# EAGLE schematic csa_petio_v1.3a (EAGLE 6.4)
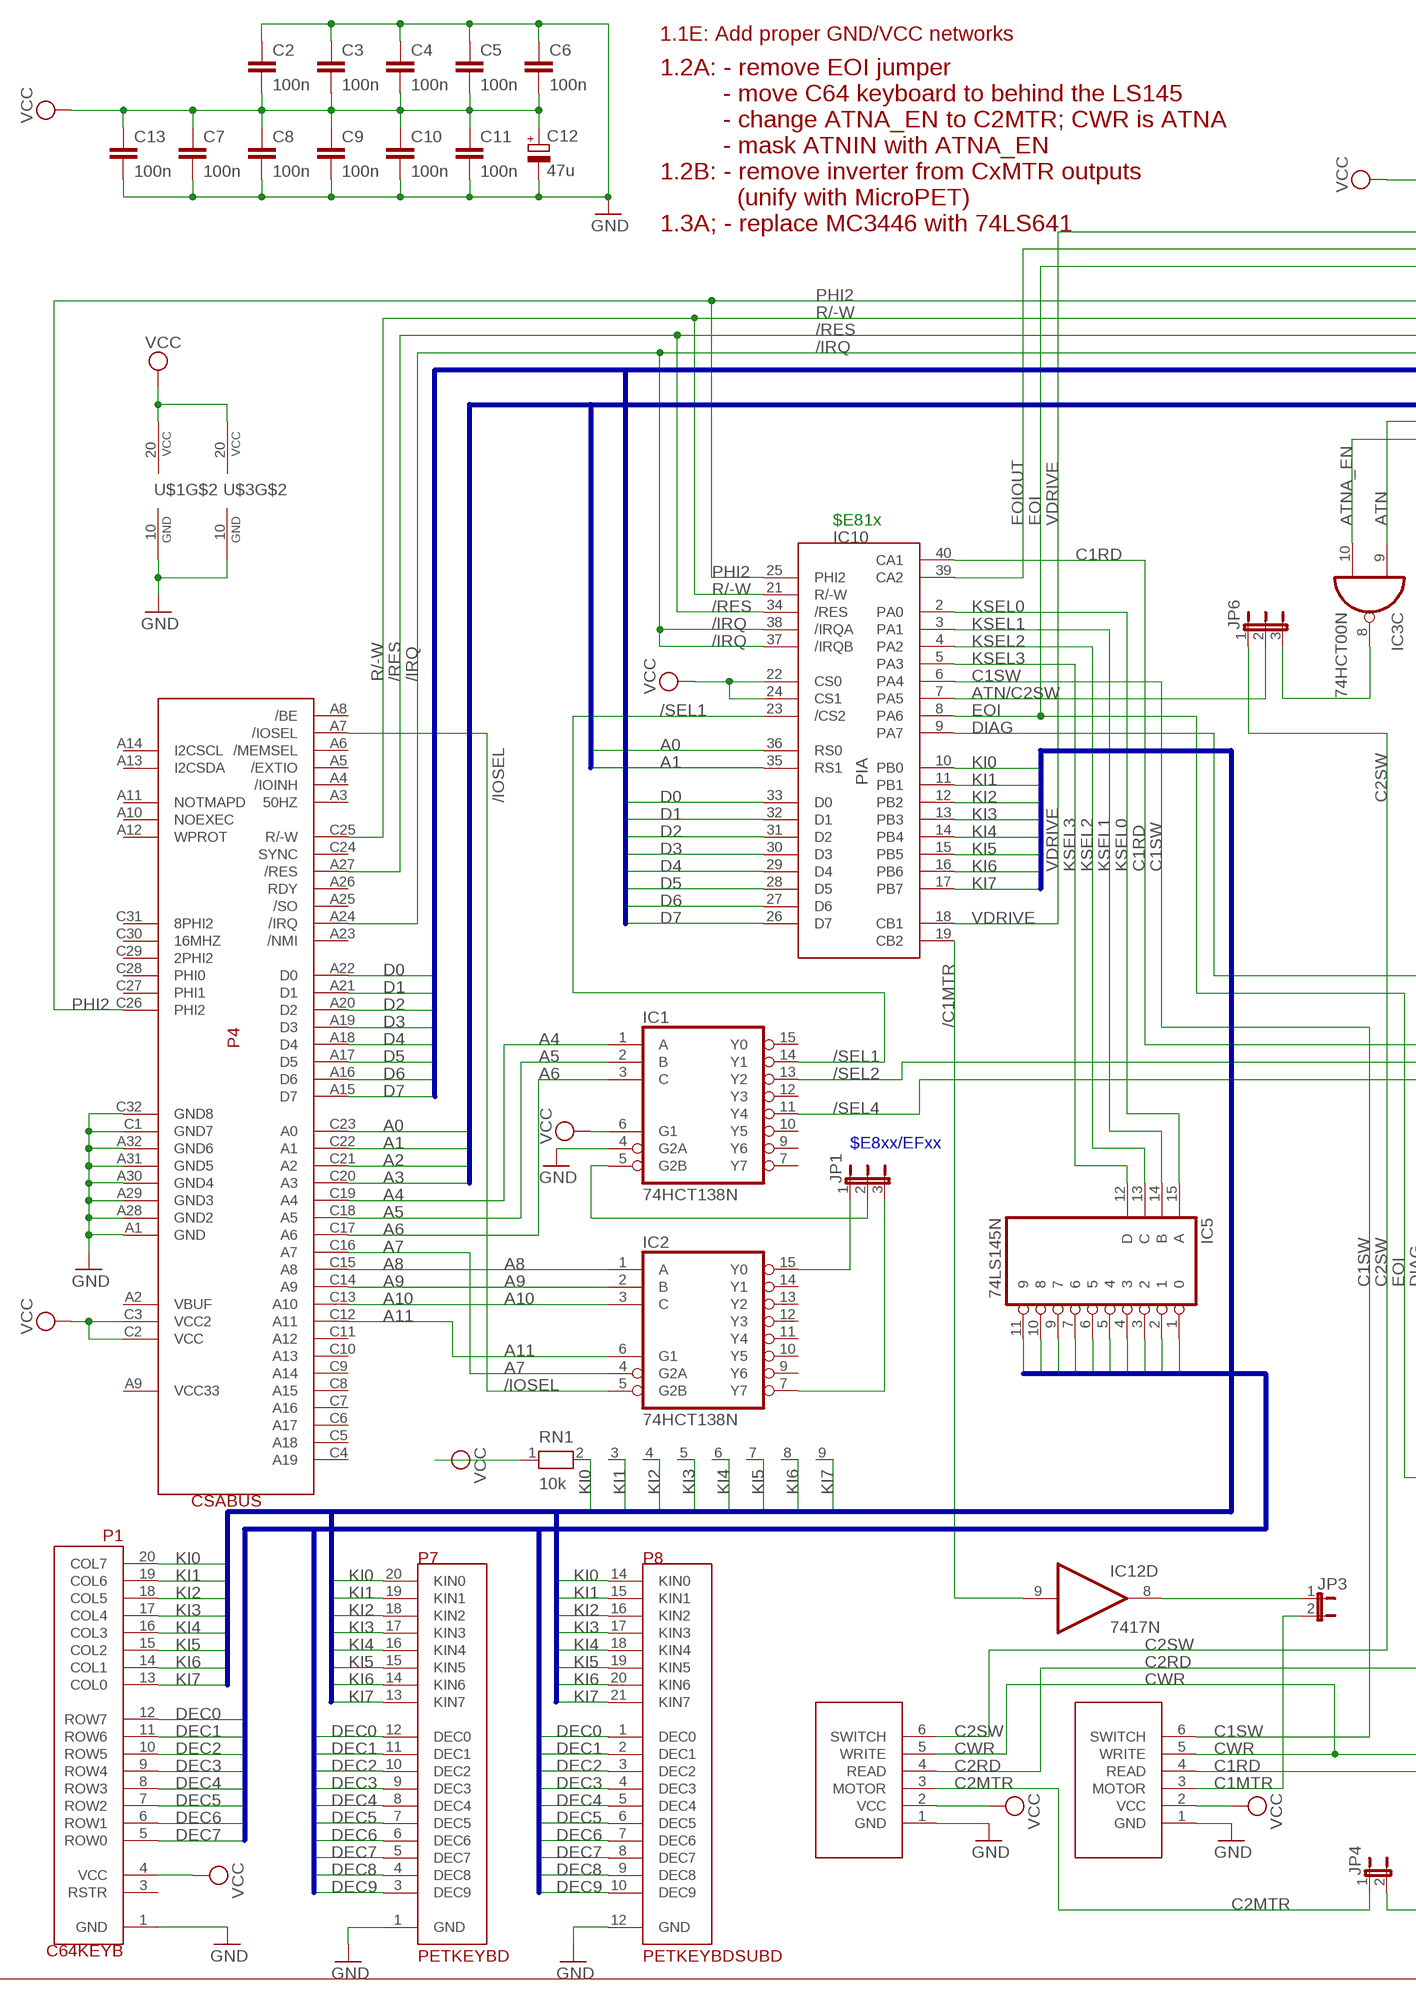
[diagram p0: schematic, sheet 1, part 1 of 2]
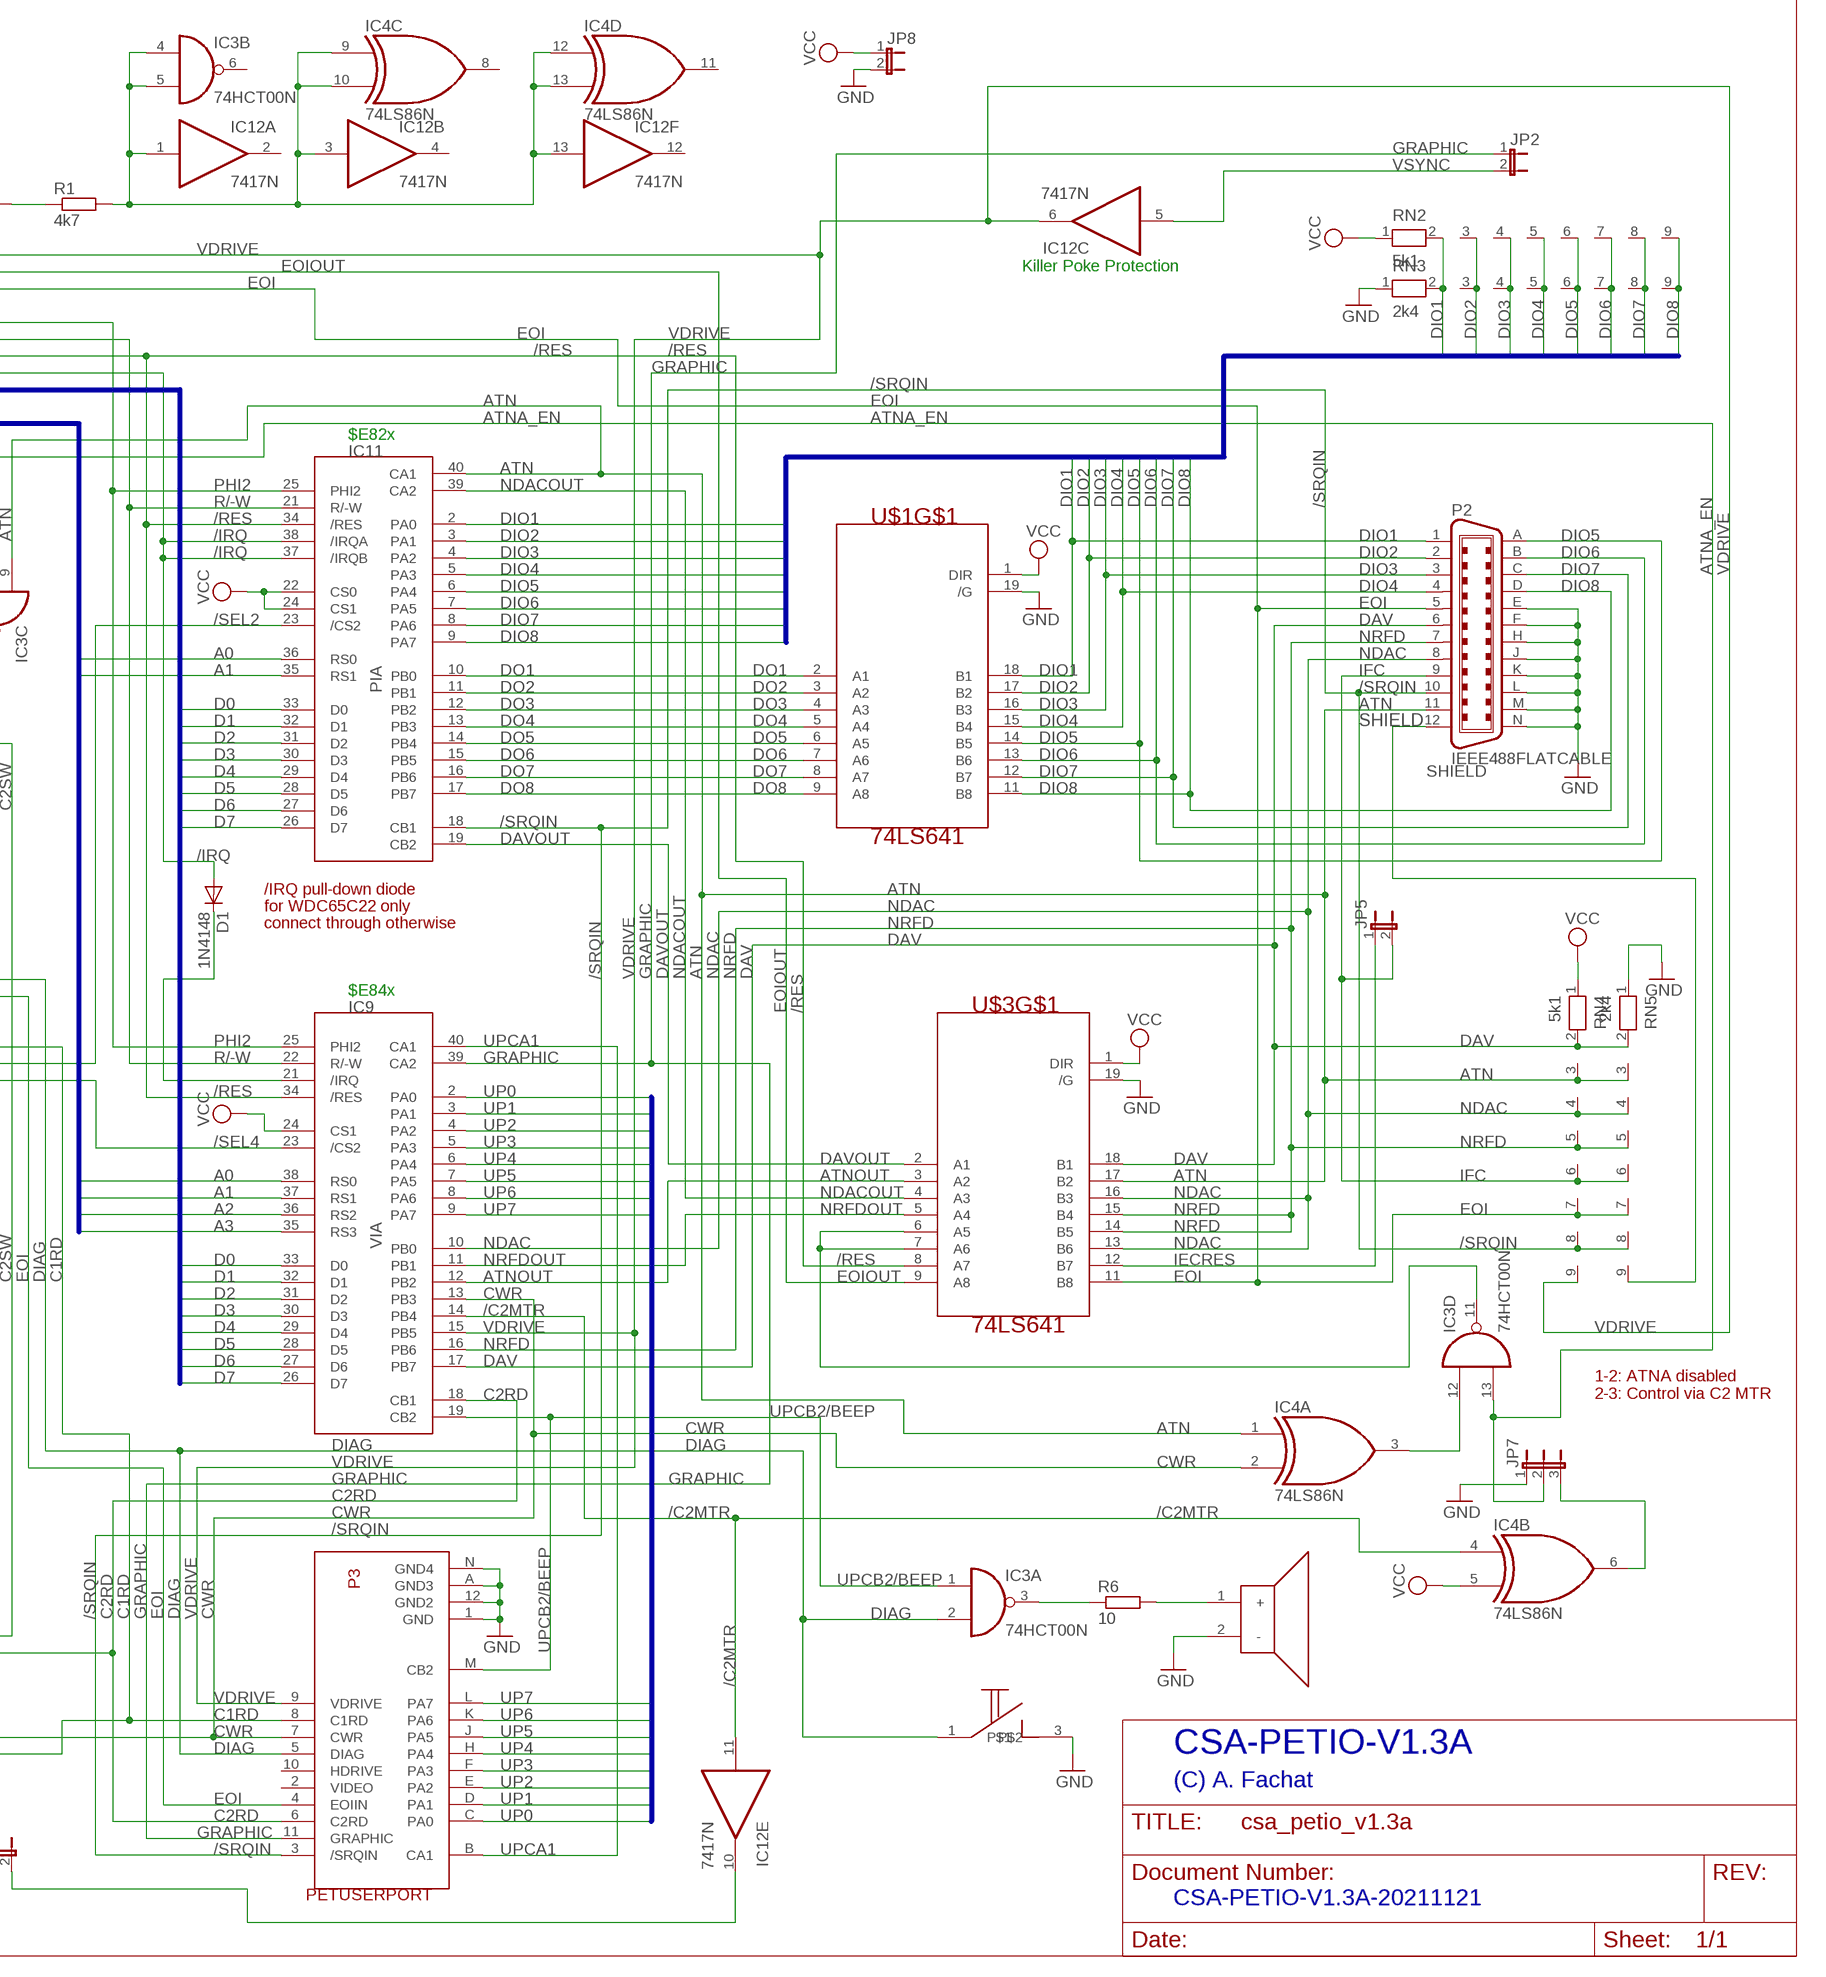
[diagram p1: schematic, sheet 1, part 2 of 2]

## Parts
BEEP1  PIEZOBEEPERPIEZO  [PIEZOBEEPER]
C2  100n  C-EU025-025X050  [C025-025X050]
C3  100n  C-EU025-025X050  [C025-025X050]
C4  100n  C-EU025-025X050  [C025-025X050]
C5  100n  C-EU025-025X050  [C025-025X050]
C6  100n  C-EU025-025X050  [C025-025X050]
C7  100n  C-EU025-025X050  [C025-025X050]
C8  100n  C-EU025-025X050  [C025-025X050]
C9  100n  C-EU025-025X050  [C025-025X050]
C10  100n  C-EU025-025X050  [C025-025X050]
C11  100n  C-EU025-025X050  [C025-025X050]
C12  47u  CPOL-EUE2.5-6  [E2,5-6]
C13  100n  C-EU025-025X050  [C025-025X050]
D1  1N4148  DIODE-D-5  [D-5]
IC1  74HCT138N  [DIL16]
IC2  74HCT138N  [DIL16]
IC3  74HCT00N  [DIL14]
IC4  74LS86N  [DIL14]
IC5  74LS145N  [DIL16]
IC9  VIA  [DIL40]
IC10  PIA  [DIL40]
IC11  PIA  [DIL40]
IC12  7417N  [DIL14]
JP1  JP2E  [JP2]
JP2  JP1E  [JP1]
JP3  JP1E  [JP1]
JP4  JP1E  [JP1]
JP5  JP1E  [JP1]
JP6  JP2E  [JP2]
JP7  JP2E  [JP2]
JP8  JP1E  [JP1]
P1  C64KEYB  [C64KEYB]
P2  IEEE488FLATCABLE  [FLAT24]
P3  PETUSERPORT  [FLAT24]
P4  CSABUS  [CSABUS]
P5  CBMTAPE  [JP6]
P6  CBMTAPE  [JP6]
P7  PETKEYBD  [C64KEYB]
P8  PETKEYBDSUBD  [SUBD25F]
R1  4k7  R-EU_0207/10  [0207/10]
R6  10  R-EU_0207/10  [0207/10]
RN1  10k  RN08  [RN-9]
RN2  5k1  RN08  [RN-9]
RN3  2k4  RN08  [RN-9]
RN4  5k1  RN08  [RN-9]
RN5  2k4  RN08  [RN-9]
U$1  74LS641  [DIL20]
U$2  TASTER  [TASTER]
U$3  74LS641  [DIL20]

## Nets
//C2MTR: IC4.6(B:O) JP7.3
/C1MTR: IC10.19(CB2) IC12.9(D:I)
/C2MTR: IC4.4(B:I0) IC9.14(PB4) IC12.11(E:I)
/IOSEL: IC2.5(G2B) P4.A7(/IOSEL)
/IRQ: D1.A IC10.37(/IRQB) IC10.38(/IRQA) IC11.37(/IRQB) IC11.38(/IRQA) P4.A24(/IRQ)
/RES: IC9.34(/RES) IC10.34(/RES) IC11.34(/RES) P4.A27(/RES) U$3.8(A7)
/SEL1: IC1.14(Y1) IC10.23(/CS2)
/SEL2: IC1.13(Y2) IC11.23(/CS2)
/SEL4: IC1.11(Y4) IC9.23(/CS2)
/SRQIN: IC11.18(CB1) P2.10 P3.3(/SRQIN) RN4.8 RN5.8
A0: IC9.38(RS0) IC10.36(RS0) IC11.36(RS0) P4.C23(A0)
A1: IC9.37(RS1) IC10.35(RS1) IC11.35(RS1) P4.C22(A1)
A2: IC9.36(RS2) P4.C21(A2)
A3: IC9.35(RS3) P4.C20(A3)
A4: IC1.1(A) P4.C19(A4)
A5: IC1.2(B) P4.C18(A5)
A6: IC1.3(C) P4.C17(A6)
A7: IC2.4(G2A) P4.C16(A7)
A8: IC2.1(A) P4.C15(A8)
A9: IC2.2(B) P4.C14(A9)
A10: IC2.3(C) P4.C13(A10)
A11: IC2.6(G1) P4.C12(A11)
ATN: IC3.9(C:I0) IC4.1(A:I0) IC11.40(CA1) P2.11 RN4.3 RN5.3 U$3.17(B2)
ATN/C2SW: IC10.7(PA5) JP6.2
ATNA_EN: IC3.10(C:I1) IC3.13(D:I1) JP7.2
ATNOUT: IC9.12(PB2) U$3.3(A2)
C1MTR: JP3.2 P5.3(MOTOR)
C1RD: IC10.40(CA1) P3.8(C1RD) P5.4(READ)
C1SW: IC10.6(PA4) P5.6(SWITCH)
C2MTR: JP4.1 P6.3(MOTOR)
C2RD: IC9.18(CB1) P3.6(C2RD) P6.4(READ)
C2SW: JP6.1 P6.6(SWITCH)
CWR: IC4.2(A:I1) IC9.13(PB3) P3.7(CWR) P5.5(WRITE) P6.5(WRITE)
D0: IC9.33(D0) IC10.33(D0) IC11.33(D0) P4.A22(D0)
D1: IC9.32(D1) IC10.32(D1) IC11.32(D1) P4.A21(D1)
D2: IC9.31(D2) IC10.31(D2) IC11.31(D2) P4.A20(D2)
D3: IC9.30(D3) IC10.30(D3) IC11.30(D3) P4.A19(D3)
D4: IC9.29(D4) IC10.29(D4) IC11.29(D4) P4.A18(D4)
D5: IC9.28(D5) IC10.28(D5) IC11.28(D5) P4.A17(D5)
D6: IC9.27(D6) IC10.27(D6) IC11.27(D6) P4.A16(D6)
D7: IC9.26(D7) IC10.26(D7) IC11.26(D7) P4.A15(D7)
DAV: IC9.17(PB7) P2.6 RN4.2 RN5.2 U$3.18(B1)
DAVOUT: IC11.19(CB2) U$3.2(A1)
DEC0: IC5.1 P1.12(ROW7) P7.12(DEC0) P8.1(DEC0)
DEC1: IC5.2 P1.11(ROW6) P7.11(DEC1) P8.2(DEC1)
DEC2: IC5.3 P1.10(ROW5) P7.10(DEC2) P8.3(DEC2)
DEC3: IC5.4 P1.9(ROW4) P7.9(DEC3) P8.4(DEC3)
DEC4: IC5.5 P1.8(ROW3) P7.8(DEC4) P8.5(DEC4)
DEC5: IC5.6 P1.7(ROW2) P7.7(DEC5) P8.6(DEC5)
DEC6: IC5.7 P1.6(ROW1) P7.6(DEC6) P8.7(DEC6)
DEC7: IC5.9 P1.5(ROW0) P7.5(DEC7) P8.8(DEC7)
DEC8: IC5.10 P7.4(DEC8) P8.9(DEC8)
DEC9: IC5.11 P7.3(DEC9) P8.10(DEC9)
DIAG: IC3.2(A:I1) IC10.9(PA7) P3.5(DIAG) U$2.1
DIO1: IC11.2(PA0) P2.1 RN2.2 RN3.2 U$1.18(B1)
DIO2: IC11.3(PA1) P2.2 RN2.3 RN3.3 U$1.17(B2)
DIO3: IC11.4(PA2) P2.3 RN2.4 RN3.4 U$1.16(B3)
DIO4: IC11.5(PA3) P2.4 RN2.5 RN3.5 U$1.15(B4)
DIO5: IC11.6(PA4) P2.A RN2.6 RN3.6 U$1.14(B5)
DIO6: IC11.7(PA5) P2.B RN2.7 RN3.7 U$1.13(B6)
DIO7: IC11.8(PA6) P2.C RN2.8 RN3.8 U$1.12(B7)
DIO8: IC11.9(PA7) P2.D RN2.9 RN3.9 U$1.11(B8)
DO1: IC11.10(PB0) U$1.2(A1)
DO2: IC11.11(PB1) U$1.3(A2)
DO3: IC11.12(PB2) U$1.4(A3)
DO4: IC11.13(PB3) U$1.5(A4)
DO5: IC11.14(PB4) U$1.6(A5)
DO6: IC11.15(PB5) U$1.7(A6)
DO7: IC11.16(PB6) U$1.8(A7)
DO8: IC11.17(PB7) U$1.9(A8)
EOI: IC10.8(PA6) P2.5 P3.4(EOIIN) RN4.7 RN5.7 U$3.11(B8)
EOIOUT: IC10.39(CA2) U$3.9(A8)
GND: BEEP1.2(-) C2.1 C3.1 C4.1 C5.1 C6.1 C7.2 C8.2 C9.2 C10.2 C11.2 C12.- C13.2 IC1.4(G2A) JP7.1 JP8.2 P1.1(GND) P2.E P2.F P2.H P2.J P2.K P2.L P2.M P2.N P3.1(GND) P3.12(GND2) P3.A(GND3) P3.N(GND4) P4.A1(GND) P4.A28(GND2) P4.A29(GND3) P4.A30(GND4) P4.A31(GND5) P4.A32(GND6) P4.C1(GND7) P4.C32(GND8) P5.1(GND) P6.1(GND) P7.1(GND) P8.12(GND) RN3.1 RN5.1 U$1.10(GND) U$1.19(/G) U$2.3 U$3.10(GND) U$3.19(/G)
GRAPHIC: IC9.39(CA2) JP2.1 P3.11(GRAPHIC)
IECRES: JP5.1 U$3.12(B7)
IFC: JP5.2 P2.9 RN4.6 RN5.6
KI0: IC10.10(PB0) P1.20(COL7) P7.20(KIN0) P8.14(KIN0) RN1.2
KI1: IC10.11(PB1) P1.19(COL6) P7.19(KIN1) P8.15(KIN1) RN1.3
KI2: IC10.12(PB2) P1.18(COL5) P7.18(KIN2) P8.16(KIN2) RN1.4
KI3: IC10.13(PB3) P1.17(COL4) P7.17(KIN3) P8.17(KIN3) RN1.5
KI4: IC10.14(PB4) P1.16(COL3) P7.16(KIN4) P8.18(KIN4) RN1.6
KI5: IC10.15(PB5) P1.15(COL2) P7.15(KIN5) P8.19(KIN5) RN1.7
KI6: IC10.16(PB6) P1.14(COL1) P7.14(KIN6) P8.20(KIN6) RN1.8
KI7: IC10.17(PB7) P1.13(COL0) P7.13(KIN7) P8.21(KIN7) RN1.9
KSEL0: IC5.15(A) IC10.2(PA0)
KSEL1: IC5.14(B) IC10.3(PA1)
KSEL2: IC5.13(C) IC10.4(PA2)
KSEL3: IC5.12(D) IC10.5(PA3)
N$1: IC3.12(D:I0) IC4.3(A:O)
N$2: IC3.11(D:O) U$3.6(A5) U$3.7(A6)
N$3: IC3.3(A:O) R6.1
N$4: BEEP1.1(+) R6.2
N$5: D1.C IC9.21(/IRQ)
N$6: IC3.8(C:O) JP6.3
N$17: IC12.8(D:O) JP3.1
N$19: IC12.10(E:O) JP4.2
N$32: IC1.5(G2B) JP1.2
N$33: IC2.15(Y0) JP1.1
N$34: IC2.7(Y7) JP1.3
NDAC: IC9.10(PB0) P2.8 RN4.4 RN5.4 U$3.13(B6) U$3.16(B3)
NDACOUT: IC11.39(CA2) U$3.4(A3)
NRFD: IC9.16(PB6) P2.7 RN4.5 RN5.5 U$3.14(B5) U$3.15(B4)
NRFDOUT: IC9.11(PB1) U$3.5(A4)
OPENHIGH: IC3.4(B:I0) IC3.5(B:I1) IC4.9(C:I0) IC4.10(C:I1) IC4.12(D:I0) IC4.13(D:I1) IC12.1(A:I) IC12.3(B:I) IC12.13(F:I) R1.2
PHI2: IC9.25(PHI2) IC10.25(PHI2) IC11.25(PHI2) P4.C26(PHI2)
R/-W: IC9.22(R/-W) IC10.21(R/-W) IC11.21(R/-W) P4.C25(R/-W)
SHIELD: P2.12 RN5.9
UP0: IC9.2(PA0) P3.C(PA0)
UP1: IC9.3(PA1) P3.D(PA1)
UP2: IC9.4(PA2) P3.E(PA2)
UP3: IC9.5(PA3) P3.F(PA3)
UP4: IC9.6(PA4) P3.H(PA4)
UP5: IC9.7(PA5) P3.J(PA5)
UP6: IC9.8(PA6) P3.K(PA6)
UP7: IC9.9(PA7) P3.L(PA7)
UPCA1: IC9.40(CA1) P3.B(CA1)
UPCB2/BEEP: IC3.1(A:I0) IC9.19(CB2) P3.M(CB2)
VCC: C2.2 C3.2 C4.2 C5.2 C6.2 C7.1 C8.1 C9.1 C10.1 C11.1 C12.+ C13.1 IC1.6(G1) IC4.5(B:I1) IC9.24(CS1) IC10.22(CS0) IC10.24(CS1) IC11.22(CS0) IC11.24(CS1) JP8.1 P1.4(VCC) P4.C2(VCC) P4.C3(VCC2) P5.2(VCC) P6.2(VCC) R1.1 RN1.1 RN2.1 RN4.1 U$1.1(DIR) U$1.20(VCC) U$3.1(DIR) U$3.20(VCC)
VDRIVE: IC9.15(PB5) IC10.18(CB1) IC12.6(C:O) P3.9(VDRIVE) RN4.9
VSYNC: IC12.5(C:I) JP2.2
Unconnected: IC1.7(Y7) IC1.9(Y6) IC1.10(Y5) IC1.12(Y3) IC1.15(Y0) IC2.9(Y6) IC2.10(Y5) IC2.11(Y4) IC2.12(Y3) IC2.13(Y2) IC2.14(Y1) IC3.6(B:O) IC4.8(C:O) IC4.11(D:O) IC12.2(A:O) IC12.4(B:O) IC12.12(F:O) P1.3(RSTR) P3.2(VIDEO) P3.10(HDRIVE) P4.A2(VBUF) P4.A3(50HZ) P4.A4(/IOINH) P4.A5(/EXTIO) P4.A6(/MEMSEL) P4.A8(/BE) P4.A9(VCC33) P4.A10(NOEXEC) P4.A11(NOTMAPD) P4.A12(WPROT) P4.A13(I2CSDA) P4.A14(I2CSCL) P4.A23(/NMI) P4.A25(/SO) P4.A26(RDY) P4.C4(A19) P4.C5(A18) P4.C6(A17) P4.C7(A16) P4.C8(A15) P4.C9(A14) P4.C10(A13) P4.C11(A12) P4.C24(SYNC) P4.C27(PHI1) P4.C28(PHI0) P4.C29(2PHI2) P4.C30(16MHZ) P4.C31(8PHI2)

## Buses
D[0..7]
A[0..3]
KI[0..7]
UP[0..7]
DEC[0..9]
DIO[1..8]

## Notes on the sheet
- 1.1E: Add proper GND/VCC networks
- 1.2A: - remove EOI jumper
           - move C64 keyboard to behind the LS145
           - change ATNA_EN to C2MTR; CWR is ATNA
           - mask ATNIN with ATNA_EN
  1.2B: - remove inverter from CxMTR outputs
             (unify with MicroPET)
  1.3A; - replace MC3446 with 74LS641
- Killer Poke Protection
- $E82x
- $E81x
- /IRQ pull-down diode
- for WDC65C22 only
- connect through otherwise
- $E84x
- $E8xx/EFxx
- 1-2: ATNA disabled
  2-3: Control via C2 MTR
- CSA-PETIO-V1.3A
- (C) A. Fachat
- CSA-PETIO-V1.3A-20211121

## Power pins joined to a net without a drawn wire
GND: IC1.8(GND) IC2.8(GND) IC3.7(P:GND) IC4.7(P:GND) IC5.8(GND) IC9.1(GND) IC10.1(GND) IC11.1(GND) IC12.7(P:GND)
VCC: IC1.16(VCC) IC2.16(VCC) IC3.14(P:VCC) IC4.14(P:VCC) IC5.16(VCC) IC9.20(VCC) IC10.20(VCC) IC11.20(VCC) IC12.14(P:VCC)

## Library data of the parts
BEEP1 = csa:PIEZOBEEPER
C2-C11 C13 = rcl:C-EU: CAPACITOR, European symbol
C12 = rcl:CPOL-EU: POLARIZED CAPACITOR, European symbol
D1 = diode:DIODE-: DIODE
IC1 IC2 = 74xx-eu:74*138: 3-line to 8-line DECODER/DEMULTIPLEXER
IC3 = 74xx-eu:74*00: Quad 2-input NAND gate
IC4 = 74xx-us:74*86: Quad 2-input EXCLUSIV-OR (XOR) gate
IC5 = 74xx-eu:74*145: BCD to decimal DECODER/DRIVER
IC9 = csa:VIA
IC10 IC11 = csa:PIA
IC12 = 74xx-eu:74*17: Hex open collector, high-voltage
JP1 JP6 JP7 = jumper:JP2E: JUMPER
JP2-JP5 JP8 = jumper:JP1E: JUMPER
P1 = csa:C64KEYB
P2 = csa:IEEE488
P3 = csa:PETUSERPORT
P4 = csa:CSABUS
P5 P6 = csa:CBMTAPE
P7 P8 = csa:PETKEYBD
R1 R6 = rcl:R-EU_: RESISTOR, European symbol
RN1-RN5 = resistor-net:RN08: RESISTOR NETWORK; OC_FARNELL: unknown; OC_NEWARK: unknown
U$1 U$3 = csa:74LS641
U$2 = csa:TASTER